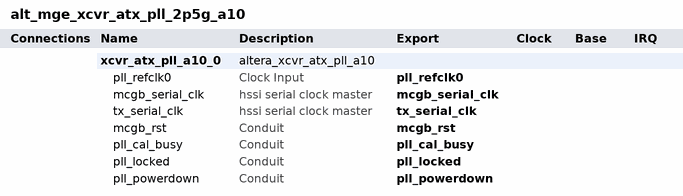
[diagram p0: system contents]
# Platform Designer (Qsys) system alt_mge_xcvr_atx_pll_2p5g_a10, Arria 10 10AX115S4F45I3SG
# Parameters at their usual value, and those the tool derives, are not listed.
package require -exact qsys 15.1
create_system alt_mge_xcvr_atx_pll_2p5g_a10
set_project_property DEVICE_FAMILY {Arria 10}
set_project_property DEVICE 10AX115S4F45I3SG

add_instance xcvr_atx_pll_a10_0 altera_xcvr_atx_pll_a10 15.1
set_instance_property xcvr_atx_pll_a10_0 AUTO_EXPORT true
set_instance_parameter_value xcvr_atx_pll_a10_0 base_device NIGHTFURY5ES2
set_instance_parameter_value xcvr_atx_pll_a10_0 enable_analog_resets 0
set_instance_parameter_value xcvr_atx_pll_a10_0 enable_atx_to_fpll_cascade_out 0
set_instance_parameter_value xcvr_atx_pll_a10_0 enable_bonding_clks 0
set_instance_parameter_value xcvr_atx_pll_a10_0 enable_fractional 0
set_instance_parameter_value xcvr_atx_pll_a10_0 enable_hfreq_clk 1
set_instance_parameter_value xcvr_atx_pll_a10_0 enable_manual_configuration 1
set_instance_parameter_value xcvr_atx_pll_a10_0 enable_mcgb 1
set_instance_parameter_value xcvr_atx_pll_a10_0 generate_docs 1
set_instance_parameter_value xcvr_atx_pll_a10_0 pma_width 64
set_instance_parameter_value xcvr_atx_pll_a10_0 rcfg_enable_avmm_busy_port 0
set_instance_parameter_value xcvr_atx_pll_a10_0 rcfg_separate_avmm_busy 0
set_instance_parameter_value xcvr_atx_pll_a10_0 select_manual_config false
set_instance_parameter_value xcvr_atx_pll_a10_0 set_auto_reference_clock_frequency 125.0
set_instance_parameter_value xcvr_atx_pll_a10_0 set_fref_clock_frequency 100.0
set_instance_parameter_value xcvr_atx_pll_a10_0 set_k_counter 1
set_instance_parameter_value xcvr_atx_pll_a10_0 set_l_cascade_counter 4
set_instance_parameter_value xcvr_atx_pll_a10_0 set_l_cascade_predivider 1
set_instance_parameter_value xcvr_atx_pll_a10_0 set_l_counter 2
set_instance_parameter_value xcvr_atx_pll_a10_0 set_m_counter 1
set_instance_parameter_value xcvr_atx_pll_a10_0 set_manual_reference_clock_frequency 100.0
set_instance_parameter_value xcvr_atx_pll_a10_0 set_output_clock_frequency 1562.5

# exported interfaces
add_interface mcgb_rst conduit end
set_interface_property mcgb_rst EXPORT_OF xcvr_atx_pll_a10_0.mcgb_rst
add_interface mcgb_serial_clk hssi_serial_clock start
set_interface_property mcgb_serial_clk EXPORT_OF xcvr_atx_pll_a10_0.mcgb_serial_clk
add_interface pll_cal_busy conduit end
set_interface_property pll_cal_busy EXPORT_OF xcvr_atx_pll_a10_0.pll_cal_busy
add_interface pll_locked conduit end
set_interface_property pll_locked EXPORT_OF xcvr_atx_pll_a10_0.pll_locked
add_interface pll_powerdown conduit end
set_interface_property pll_powerdown EXPORT_OF xcvr_atx_pll_a10_0.pll_powerdown
add_interface pll_refclk0 clock sink
set_interface_property pll_refclk0 EXPORT_OF xcvr_atx_pll_a10_0.pll_refclk0
add_interface tx_serial_clk hssi_serial_clock start
set_interface_property tx_serial_clk EXPORT_OF xcvr_atx_pll_a10_0.tx_serial_clk

set_interconnect_requirement {$system} qsys_mm.clockCrossingAdapter HANDSHAKE
set_interconnect_requirement {$system} qsys_mm.insertDefaultSlave FALSE
set_interconnect_requirement {$system} qsys_mm.maxAdditionalLatency 1

save_system alt_mge_xcvr_atx_pll_2p5g_a10.qsys
